# Altium schematic sheet ESP32_S3.SchDoc
size A3; SheetNumber: 8; SheetTotal: 12
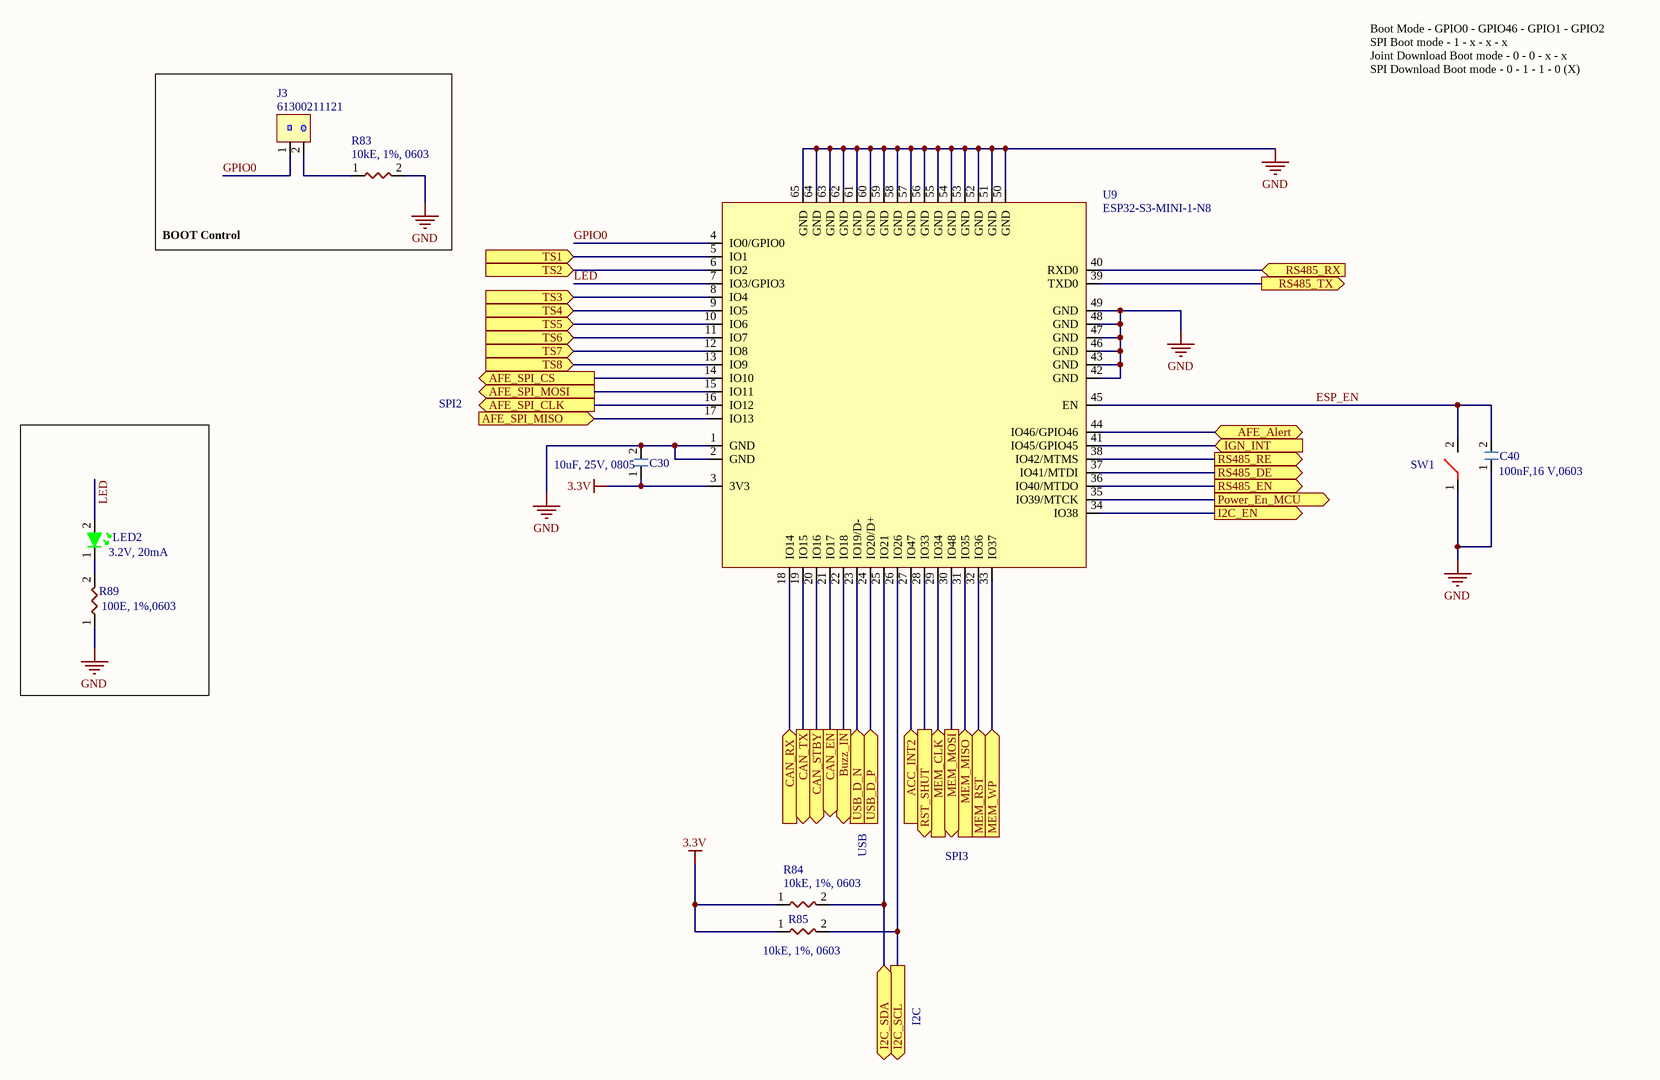
[diagram p0: ESP32_S3.SchDoc]

## Parts
C30  Value Display: 10uF, 25V, 0805  [CAPC2012X13N 0805]  (hidden comment: GRM21BZ71E106KE15L)
C40  Value Display: 100nF,16 V,0603  [CAPC1608X05N 0603]  (hidden comment: CC0603KRX7R7BB104)
J3  61300211121  [Con_61300211121]
LED2  Value Display: 3.2V, 20mA  [DIOC1610X08N LED]  (hidden comment: 150060GS75000)
R83  Value Display: 10kE, 1%, 0603  [RESC1608X05N 0603]  (hidden comment: CRCW060310K0FKEA)
R84  Value Display: 10kE, 1%, 0603  [RESC1608X05N 0603]  (hidden comment: CRCW060310K0FKEA)
R85  Value Display: 10kE, 1%, 0603  [RESC1608X05N 0603]  (hidden comment: CRCW060310K0FKEA)
R89  Value Display: 100E, 1%,0603  [RESC1608X05N 0603]  (hidden comment: AF0603FR-07100RL)
SW1  TL3305AF260QG  [SW_TL3305AF260QG]  (value not drawn)
U9  ESP32-S3-MINI-1-N8  [ESP32-S3_MINI]

## Blocks framed on the sheet
BOOT Control: J3 R83

## Ports
ACC_INT2 (in), AFE_Alert (bidir), AFE_SPI_CLK (out), AFE_SPI_CS (out), AFE_SPI_MISO (in), AFE_SPI_MOSI (out), Buzz_IN (out), CAN_EN (out), CAN_RX (in), CAN_STBY (out), CAN_TX (out), I2C_EN (out), I2C_SCL (out), I2C_SDA (bidir), IGN_INT (in), MEM_CLK (in), MEM_MISO (in), MEM_MOSI (out), MEM_RST (in), MEM_WP (in), Power_En_MCU (out), RS485_DE (out), RS485_EN (out), RS485_RE (out), RS485_RX (in), RS485_TX (out), RST_SHUT (out), TS1 (in), TS2 (in), TS3 (in), TS4 (in), TS5 (in), TS6 (in), TS7 (in), TS8 (in), USB_D_N (in), USB_D_P (in)

## Nets
3.3V: C30.1 R84.1 R85.1 U9.3(3V3)
GND: C30.2 C40.1 R83.2 R89.1 SW1.1 U9.1(GND) U9.2(GND) U9.42(GND) U9.43(GND) U9.46(GND) U9.47(GND) U9.48(GND) U9.49(GND) U9.50(GND) U9.51(GND) U9.52(GND) U9.53(GND) U9.54(GND) U9.55(GND) U9.56(GND) U9.57(GND) U9.58(GND) U9.59(GND) U9.60(GND) U9.61(GND) U9.62(GND) U9.63(GND) U9.64(GND) U9.65(GND)
ACC_INT2: U9.27(IO47) ; port ACC_INT2
AFE_Alert: U9.44(IO46/GPIO46) ; port AFE_Alert
AFE_SPI_CLK: U9.16(IO12) ; port AFE_SPI_CLK
AFE_SPI_CS: U9.14(IO10) ; port AFE_SPI_CS
AFE_SPI_MISO: U9.17(IO13) ; port AFE_SPI_MISO
AFE_SPI_MOSI: U9.15(IO11) ; port AFE_SPI_MOSI
Buzz_IN: U9.22(IO18) ; port Buzz_IN
CAN_EN: U9.21(IO17) ; port CAN_EN
CAN_RX: U9.18(IO14) ; port CAN_RX
CAN_STBY: U9.20(IO16) ; port CAN_STBY
CAN_TX: U9.19(IO15) ; port CAN_TX
ESP_EN: C40.2 SW1.2 U9.45(EN)
GPIO0: J3.1 U9.4(IO0/GPIO0)
I2C_EN: U9.34(IO38) ; port I2C_EN
I2C_SCL: R85.2 U9.26(IO26) ; port I2C_SCL
I2C_SDA: R84.2 U9.25(IO21) ; port I2C_SDA
IGN_INT: U9.41(IO45/GPIO45) ; port IGN_INT
LED: LED2.2(Anode) U9.7(IO3/GPIO3)
MEM_CLK: U9.29(IO34) ; port MEM_CLK
MEM_MISO: U9.31(IO35) ; port MEM_MISO
MEM_MOSI: U9.30(IO48) ; port MEM_MOSI
MEM_RST: U9.32(IO36) ; port MEM_RST
MEM_WP: U9.33(IO37) ; port MEM_WP
Power_En_MCU: U9.35(IO39/MTCK) ; port Power_En_MCU
RS485_DE: U9.37(IO41/MTDI) ; port RS485_DE
RS485_EN: U9.36(IO40/MTDO) ; port RS485_EN
RS485_RE: U9.38(IO42/MTMS) ; port RS485_RE
RS485_RX: U9.40(RXD0) ; port RS485_RX
RS485_TX: U9.39(TXD0) ; port RS485_TX
RST_SHUT: U9.28(IO33) ; port RST_SHUT
TS1: U9.5(IO1) ; port TS1
TS2: U9.6(IO2) ; port TS2
TS3: U9.8(IO4) ; port TS3
TS4: U9.9(IO5) ; port TS4
TS5: U9.10(IO6) ; port TS5
TS6: U9.11(IO7) ; port TS6
TS7: U9.12(IO8) ; port TS7
TS8: U9.13(IO9) ; port TS8
USB_D_N: U9.23(IO19/D-) ; port USB_D_N
USB_D_P: U9.24(IO20/D+) ; port USB_D_P
NetJ3_2: J3.2 R83.1
NetLED2_1: LED2.1(Cathode) R89.2

## Notes on the sheet
- Boot Mode - GPIO0 - GPIO46 - GPIO1 - GPIO2
  SPI Boot mode - 1 - x - x - x
  Joint Download Boot mode - 0 - 0 - x - x
  SPI Download Boot mode - 0 - 1 - 1 - 0 (X)
- SPI2
- USB
- SPI3
- I2C

## Library data of the parts
C30 = Cap_GRM21BZ71E106KE15L: Multilayer Ceramic Capacitor, 10 uF, 25V, ±10%,  X7R 0805 (2012 Metric); Manufacturer: Murata; AEC-Q: NA; Max Temp: 125 degC; Min Temp: -55 degC; Polarized: No; Value: 10 uF; Category: Capacitor; ComponentLink1Description: Datasheet; ComponentLink1URL: https://search.murata.co.jp/Ceramy/image/img/A01X/G101/ENG/GRM21BZ71E106KE15-01.pdf; Manufacturer Part Number: GRM21BZ71E106KE15L; Mount Type: Surface Mount; Package: 0805; RoHS: Yes; Supplier 1: Digikey; Supplier 1 Part Number: 490-GRM21BZ71E106KE15LCT-ND; Supplier 1 pricing per Unit: 28.51 INR; Supplier: Mouser; Supplier Part Number: 81-GRM21BZ71E106KE5L; Supplier pricing per Unit: 30.02 INR; Technology: Ceramic; Temp Coefficient: X7R; Tolerance: 10%; Value 1: GRM21BZ71E106KE15L; Voltage: 25V
C40 = Cap_CC0603KRX7R7BB104: Multilayer Ceramic Capacitor, 100 nF, 16V, ±10%,  X7R 0603 [1608 Metric]; Manufacturer: Yageo; Value: 100nF; Max Temp: 125 degC; Min Temp: -55 degC; Polarized: No; AEC-Q: NA; Manufacturer Part Number: CC0603KRX7R7BB104; Category: Capacitor; ComponentLink1Description: Datasheet; Mount Type: Surface Mount; Package: 0603; RoHS: Yes; Supplier 1: Digikey; Supplier 1 Part Number: 311-1088-1-ND; Supplier 1 pricing per Unit: 8.34 INR; Supplier: Mouser; Supplier Part Number: 603-CC603KRX7R7BB104; Supplier pricing per Unit: 8.34 INR; Technology: Ceramic; Temp Coefficient: X7R; Tolerance: 10%; Value 1: CC0603KRX7R7BB104; Voltage: 16V; ComponentLink1URL: https://www.yageo.com/upload/media/product/productsearch/datasheet/mlcc/UPY-GPHC_X7R_6.3V-to-250V_24.pdf
J3 = Con_61300211121: Connector Header Through Hole 2 position 0.100" (2.54mm); Crimp Part Number: 609002115121; Manufacturer: Wurth Electronik; AEC-Q: NA; Circuits: 2; No. of Rows: 1; Value: 2 Pin; Value Display: 2 Pin/Vert/TH; Alternate 2 Part Number (Right Angled): *; Alternate Part Number: *; Category: Connector; Colour: Black; ComponentLink1Description: Datasheet; ComponentLink1URL: https://www.we-online.com/components/products/datasheet/61300211121.pdf; Manufacturer Part Number: 61300211121; Mating Part Number: 609002115121; Mount Type: TH; Package: THT; Pitch: 2.54 mm; RoHS: Yes; Supplier 1: Digikey; Supplier 1 Part Number: 732-5315-ND; Supplier 1 pricing per Unit: 10.93 INR; Supplier: Mouser; Supplier Part Number: 710-61300211121; Supplier pricing per Unit: 10.84 INR; Value 1: 61300211121
LED2 = LED_150060GS75000: Green 520nm LED Indication - Discrete 3.2V 0603 (1608 Metric); Manufacturer: Wurth Electronik; AEC-Q: NA; Max Temp: 85 degC; Min Temp: -40 degC; Value: 20mA; Power: 105mW; Category: LED; Colour: Green; ComponentLink1Description: Datasheet; ComponentLink1URL: https://www.we-online.com/components/products/datasheet/150060GS75000.pdf; Manufacturer Part Number: 150060GS75000; Mount Type: Surface Mount; Package: 0603; RoHS: Yes; Supplier 1: Digikey; Supplier 1 Part Number: 732-4971-1-ND; Supplier 1 pricing per Unit: 12.51 INR; Supplier: Mouser; Supplier Part Number: 710-150060GS75000; Supplier pricing per Unit: 12.51 INR; Value 1: 150060GS75000
R83-R85 = Res_CRCW060310K0FKEA: SMD Chip Resistor, 10 kOhm,±1%, 100 mW, 0603 [1608 Metric], Thick Film, General Purpose; Manufacturer: Vishay Dale; AEC-Q: 200; Max Temp: 155 degC; Min Temp: -55 degC; Power: 1/10W; Value: 10k R; Category: Resistor; ComponentLink1Description: Datasheet; ComponentLink1URL: https://www.vishay.com/docs/20035/dcrcwe3.pdf; Manufacturer Part Number: CRCW060310K0FKEA; Mount Type: Surface Mount; Package: 0603; RoHS: Yes; Supplier 1: Digikey; Supplier 1 Part Number: 541-10.0KHCT-ND; Supplier 1 pricing per Unit: 8.34 INR; Supplier: Mouser; Supplier Part Number: 71-CRCW0603-10K-E3; Supplier pricing per Unit: 8.34 INR; Tolerance: 1%; Value 1: CRCW060310K0FKEA
R89 = Res_AF0603FR-07100RL: SMD Chip Resistor,100 Ohms ±1%, 1/10W, 0603 (1608 Metric) Anti-Sulfur, Automotive AEC-Q200 Thick Film; Manufacturer: Yageo; Value: 100R; AEC-Q: 200; Max Temp: 155 degC; Min Temp: -55 degC; Category: Resistor; Tolerance: 1%; Package: 0603; Manufacturer Part Number: AF0603FR-07100RL; RoHS: Yes; Power: 1/10W; Supplier: Mouser; Supplier 1 pricing per Unit: 8.34 INR; ComponentLink1Description: Datasheet; ComponentLink1URL: https://www.yageo.com/upload/media/product/app/datasheet/rchip/pyu-af_51_rohs_l.pdf; Supplier 1: Digikey; Value 1: AF0603FR-07100RL; Supplier 1 Part Number: 13-AC0603FR-10150RLCT-ND; Supplier Part Number: 603-AF0603FR-07100RL; Supplier pricing per Unit: 8.34 INR; Mount Type: Surface Mount
SW1 = Sw_TL3305AF260QG: SWITCH TACTILE SPST-NO 0.05A 12V; Manufacturer: E Switch; Category: Switch; ComponentLink1Description: Datasheet; ComponentLink1URL: https://configured-product-images.s3.amazonaws.com/Datasheets/TL3305.pdf; Manufacturer Part Number: TL3305AF260QG; Mount Type: Surface Mount; Package: SMT; RoHS: Yes; Supplier 1: Digikey; Supplier 1 Part Number: EG5353CT-ND; Supplier 1 pricing per Unit: 17.61 INR; Supplier: Mouser; Supplier Part Number: 612-TL3305AF260QG; Supplier pricing per Unit: 17.51 INR; Value 1: TL3305AF260QG; Value: TL3305AF260QG; Value Display: TL3305AF260QG
U9 = IC_ESP32-S3-MINI-1-N8: Multiprotocol Modules SMD module, ESP32-S3FN8, 8 MB SPI flash, PCB antenna; Manufacturer: Espressif; AEC-Q: NA; Data Flash: 8 MB; Max Temp: 85 degC; Min Temp: -40 degC; Value Display: MCU; Category: MCU; ComponentLink1Description: Datasheet; ComponentLink1URL: https://www.espressif.com/sites/default/files/documentation/esp32-s3-mini-1_mini-1u_datasheet_en.pdf; Manufacturer Part Number: ESP32-S3-MINI-1-N8; Mount Type: Surface Mount; Package: Module; RoHS: Yes; Supplier 1: Digikey; Supplier 1 Part Number: 1965-ESP32-S3-MINI-1-N8CT-ND; Supplier 1 pricing per Unit: 259.84 INR; Supplier: Mouser; Supplier Part Number: 356-ESP32-S3-MINI1N8; Supplier pricing per Unit: 258.54 INR; Value 1: ESP32-S3-MINI-1-N8; Value: ESP32-S3-MINI-1-N8